# Altium schematic sheet Timer.SchDoc
size A; SheetNumber: 1; SheetTotal: 1
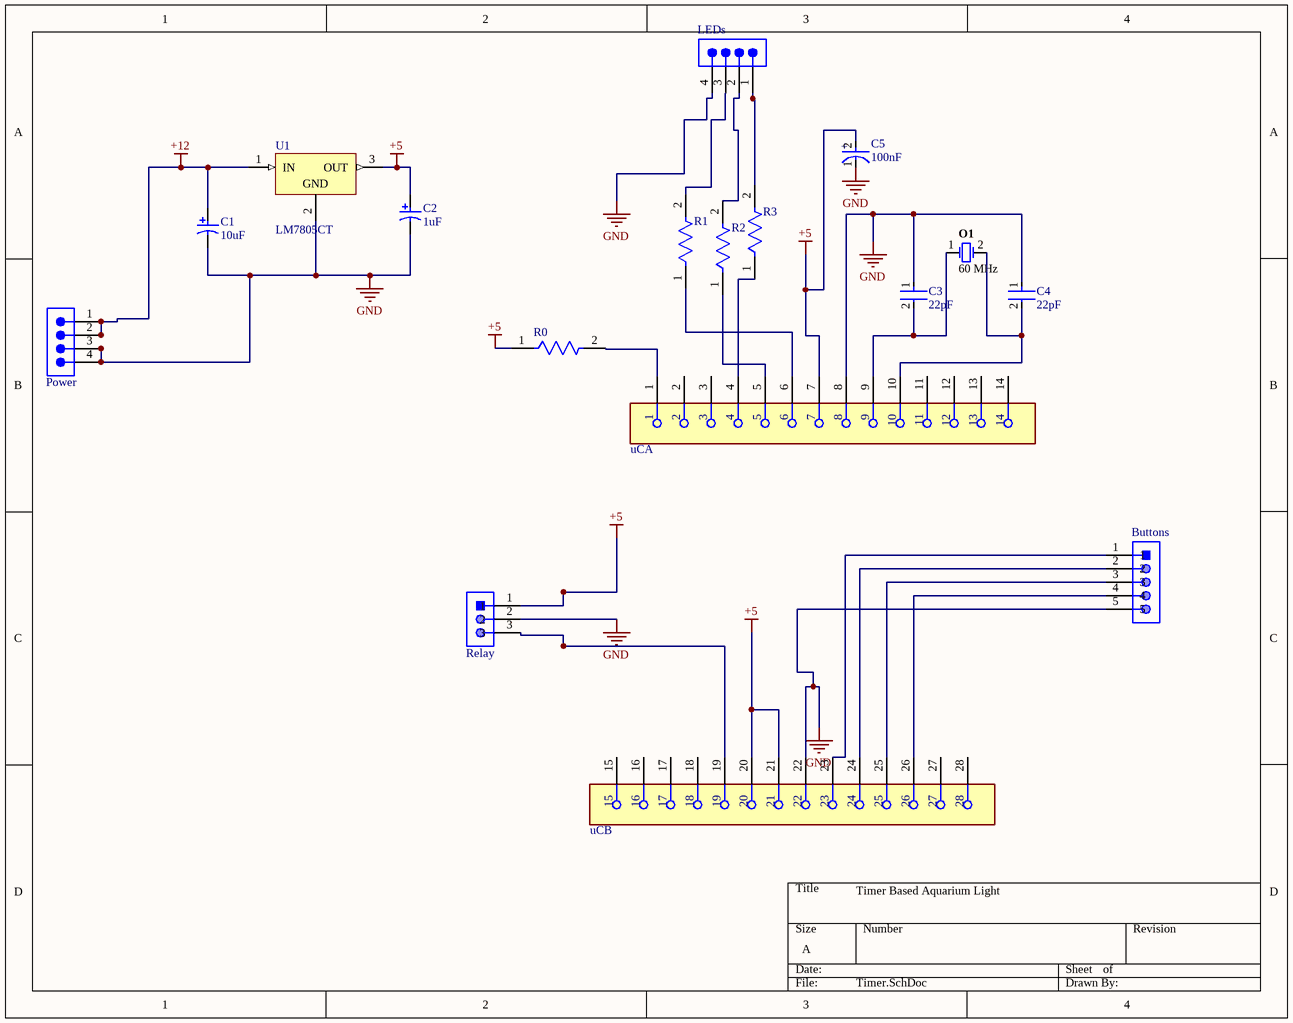
[diagram p0: Timer.SchDoc]

## Parts
Buttons  61300511121  [61300511121]  (value not drawn)
C1  10uF  [CAPPR55-200-1100X500X1200]
C2  1uF  [CAPPR55-200-1100X500X1200]
C3  22pF  [FP-RCE0DB-MFG]
C4  22pF  [FP-RCE0DB-MFG]
C5  100nF  [FP-RAD-TH-D_5_0_5-L_11_1-MFG]
LEDs  TSW-104-08-G-S  [SMTC-TSW-104-08-X-S]  (value not drawn)
O1  60 MHz  [FOX-FOXSLF160-20]
Power  TSW-104-08-G-S  [SMTC-TSW-104-08-X-S]  (value not drawn)
R0  CF18JT2K20  [FP-CF18-MFG]  (value not drawn)
R1  CF18JT2K20  [FP-CF18-MFG]  (value not drawn)
R2  CF18JT2K20  [FP-CF18-MFG]  (value not drawn)
R3  CF18JT2K20  [FP-CF18-MFG]  (value not drawn)
Relay  61900311121  [61900311121]  (value not drawn)
U1  LM7805CT  [FAIR-TO-220-3]
uC  1-2199298-9  [FP-1-2199298-9-MFG]  (value not drawn)  (parts A,B of 2)

## Nets
+5: C2.1 C5.2(A) R0.1 Relay.1 U1.3(OUT) uC.7 uC.20 uC.21
+12: C1.1 Power.1 Power.2 U1.1(IN)
GND: Buttons.5 C1.2 C2.2 C3.1 C4.1 C5.1(C) LEDs.4 Power.3 Power.4 Relay.2 U1.2(GND) uC.8 uC.22
NetButtons_1: Buttons.1 uC.23
NetButtons_2: Buttons.2 uC.24
NetButtons_3: Buttons.3 uC.25
NetButtons_4: Buttons.4 uC.26
NetC3_2: C3.2 O1.1 uC.9
NetC4_2: C4.2 O1.2 uC.10
NetLEDs_1: LEDs.1 R3.2
NetLEDs_2: LEDs.2 R2.2
NetLEDs_3: LEDs.3 R1.2
NetR0_2: R0.2 uC.1
NetR1_1: R1.1 uC.6
NetR2_1: R2.1 uC.5
NetR3_1: R3.1 uC.4
NetRelay_3: Relay.3 uC.19

Not connected (* = marked no-connect by the designer): uC 2 3 11 12 13 14 15 16 17 18 27 28

## Notes on the sheet
- Timer Based Aquarium Light
- (in symbol CMP-05427-001672-1) +

## Library data of the parts
Buttons = CMP-1502-01068-1: THT Vertical Pin Header WR-PHD, Pitch 2.54 mm, Single Row, 5 pins; Manufacturer: Wurth Elektronik; Pin Number: 5; Contact Resistance: 20mOhm; Working Voltage: 250VAC; Pitch: 2.54mm; Withstanding Voltage: 500VAC; Rated Current: 3A; Gender: Male; Datasheet URL: https://katalog.we-online.de/em/datasheet/6130xx11121.pdf; Orientation: Vertical; Mounting Technology: THT; Row Number: Single; Package Reference: 61300511121; Publisher: WurthElektronik; Part Number: 61300511121; Packaging: Bag; Manufacturer URL: http://www.we-online.de; Operating Temperature: -40to105degC
C1 = CMP-1665-00038-2: Aluminum Electrolytic Capacitor, 10 uF, +/- 20%, 50 V, -40 to 85 degC, 2-Pin THD, RoHS, Bulk; Manufacturer: Panasonic; Life (Hours): 2000Hour; Lead/Base Style: Straight; Dissipation Factor: 0.12%; Leakage Current: 3uA; Dielectric Material: Aluminium; Lead Diameter: 0.5mm; Voltage Rating: 50V; Ripple Current: 65mA; Package Reference: CAPPR55-200-1100X500X1200; Height: 11mm; Diameter: 5mm; REACH SVHC: NoSVHC; Mount: ThroughHole; Packaging: Bulk; Manufacturer URL: http://www.panasonic.com/; Capacitance: 10uF; Termination: Radial; Datasheet URL: https://industrial.panasonic.com/cdbs/www-data/pdf/RDF0000/ABA0000C1218.pdf; Lead Free: LeadFree; Height - Seated (Max): 0.472inch; Case/Package: Radial; Package Description: 2-Pin Radial Lead, Dia 5 mm, Height 12 mm; Tolerance: 20%; Datasheet Version: Rev. 05, 10/2016; Package Quantity: 200; Ripple Current (AC): 65mA; Min Operating Temperature: -40degC; RoHSCompliant: true; Number of Pins: 2; Max Operating Temperature: 85degC; Voltage: 50V; Lead Pitch: 2mm; Radiation Hardening: No; Voltage Rating (DC): 50V; Length: 11mm
C2 = CMP-1665-00038-2: Aluminum Electrolytic Capacitor, 10 uF, +/- 20%, 50 V, -40 to 85 degC, 2-Pin THD, RoHS, Bulk; Manufacturer: Panasonic; Life (Hours): 2000Hour; Lead/Base Style: Straight; Dissipation Factor: 0.12%; Capacitance: 10uF; Leakage Current: 3uA; Dielectric Material: Aluminium; Lead Diameter: 0.5mm; Voltage Rating: 50V; Ripple Current: 65mA; Package Reference: CAPPR55-200-1100X500X1200; Height: 11mm; Diameter: 5mm; REACH SVHC: NoSVHC; Mount: ThroughHole; Packaging: Bulk; Manufacturer URL: http://www.panasonic.com/; Termination: Radial; Datasheet URL: https://industrial.panasonic.com/cdbs/www-data/pdf/RDF0000/ABA0000C1218.pdf; Lead Free: LeadFree; Height - Seated (Max): 0.472inch; Case/Package: Radial; Package Description: 2-Pin Radial Lead, Dia 5 mm, Height 12 mm; Tolerance: 20%; Datasheet Version: Rev. 05, 10/2016; Package Quantity: 200; Ripple Current (AC): 65mA; Min Operating Temperature: -40degC; RoHSCompliant: true; Number of Pins: 2; Max Operating Temperature: 85degC; Voltage: 50V; Lead Pitch: 2mm; Radiation Hardening: No; Voltage Rating (DC): 50V; Length: 11mm
C3 C4 = CMP-06035-047347-1: Cap Ceramic 22pF 100V C0G ±5% Radial 2.5mm +125°C Ammo Pack; Lead Diameter: 0.5mm; Lead/Base Style: Straight; Height: 3.5mm; Voltage: 100V; Mount: Through Hole; Min Operating Temperature: -55°C; Height - Seated (Max): 0.138inch; Dielectric: C0G; Width: 0.098inch; Depth: 2.5mm; Lead Pitch: 0.098inch; Packaging: Tape and Reel; Voltage Rating (DC): 100V; Capacitance: 22pF; Package Quantity: 2000; Max Operating Temperature: 125°C; Tolerance: 5%; Termination: Radial; Voltage Rating: 100V; Case/Package: Radial; Resistor Type: Ceramic; Length: 3.6mm; Ratings: AEC-Q200
C5 = CMP-05427-001672-1: Aluminum Electrolytic Capacitors (Radial Lead Type) 68uF ±20% 16V; Ripple Current: 280mA; Polarity: Polar; ESR (Equivalent Series Resistance): 300mR; Lead Diameter: 0.5mm; Life (Hours): 5000Hour; Voltage Rating: 16V; Tolerance: 20%; Lead Pitch: 5mm; Mount: Through Hole; Radiation Hardening: No; Capacitance: 68uF; Termination: Radial; Max Operating Temperature: 105°C; Min Operating Temperature: -40°C; Height: 11mm; Features: General Purpose; Height - Seated (Max): 0.433inch; Package Quantity: 2000; Voltage Rating (DC): 16V; Length: 11mm; Packaging: Tape and Reel; Diameter: 5mm; Series: FR; Impedance: 300mR; RoHS Compliant: Yes; REACH SVHC: No SVHC; Case/Package: Radial
LEDs Power = CMP-1024-00357-1: 0.025" SQ Post Header, Through-hole, Vertical, -55 to 125 degC, 2.54 mm Pitch, 4-Pin, Male, RoHS; Manufacturer: Samtec; Pitch: 2.54 mm; RoHS: True; ComponentLink3URL: http://www.samtec.com/documents/webfiles/cpdf/TSW-XXX-XX-XXX-X-XX-XXX-MKT.pdf; Mounting Technology: Through-hole; ComponentLink2URL: http://www.samtec.com/documents/webfiles/pdf/TSW_TH.PDF; ComponentLink1URL: http://www.samtec.com; ComponentLink3Description: Package Specification; PackageVersion: DM, 8/1988; ComponentLink2Description: Datasheet; PackageReference: TSW-104-08-X-S; PackageDescription: .025[0.64] SQ. Post Terminal Strip Assembly; PartNumber: TSW-104-08-G-S; ComponentLink1Description: Manufacturer URL; Temperature Range: -55 to 125 degC; DatasheetVersion: F-214; Orientation: Vertical
O1 = CMP-1749-00003-1: Resistance Weld Thru-Hole Crystal, 16 MHz, -20 to 70 degC, 2-Pin THD, RoHS, Bulk; Voltage Rating: 250 V; Tolerance: 1%; Resistance: 221 kohm; Case\Package: Axial; Power Rating: 250 mW; RoHSCompliant: true; Package Quantity: 200; Packaging: Bulk; Min Operating Temperature: -55 degC; DatasheetVersion: Mar-15; ComponentLink1URL: http://www.foxonline.com/; Max Operating Temperature: 155 degC; PackageReference: FOXSLF160-20; Mount: Through Hole; PackageDescription: 2-Pin Through Hole Device, Body 11.35 x 4.65 mm; ComponentLink1Description: Manufacturer URL; ComponentLink2URL: http://www.foxonline.com/pdfs/hc49slf.pdf; ComponentLink2Description: Datasheet; Length: 0.248 inch
R0-R3 = CMP-26528-000001-1: RES 2.2K OHM 1/8W 5% CF AXIAL; Manufacturer: Stackpole Electronics Inc; Value: 2.2kΩ; Voltage Rating: 250V; Temperature Coefficient: 0/-400ppm/°C; Power Rating: 0.125W; Composition: Carbon Film; Octopart: https://octopart.com/cf18jt2k20-stackpole+electronics-19205714; Tolerance: 5%; Series: CF; Temperature Range Low: -55°C; ComponentLink2URL: https://www.seielect.com/catalog/sei-cf_cfm.pdf; Ipc Land Pattern Name: RESAD656W65L360D200; Package: CF18; Device Class L2: Resistors; Device Class L3: Through-Hole Resistors; Resistance: 2.2kΩ; Height: 2mm; Category: Res; ComponentLink2Description: Datasheet; Manufacturer Part Number: CF18JT2K20; Lead Free: Yes; Temperature Range High: +155°C; Temperature: -55°C to +155°C; RoHS: TRUE; Device Class L1: Passive Components; Digikey Description: RES 2.2K OHM 1/8W 5% CF AXIAL; Automotive: No
Relay = CMP-1502-00585-1: Male Locking Header WR-WTB, THT, Vertical, pitch 2.54 mm, 1 x 3 position; Manufacturer: Wurth Elektronik; Contact Resistance: 20mOhm; Pitch: 2.54mm; Working Voltage: 250VAC; Position: 1x3; Mounting Technology: THT; Operating Temperature: -40to105degC; Part Number: 61900311121; Datasheet URL: https://katalog.we-online.de/em/datasheet/6190xx11121.pdf; Manufacturer URL: http://www.we-online.de; Publisher: WurthElektronik; Orientation: Vertical; Gender: Male; Package Reference: 61900311121; Packaging: Bag
U1 = CMP-2000-04938-1: Positive Voltage Regulator, 5 V, 1 A, -40 to 125 degC, 3-Pin TO-220, RoHS, Tube; Manufacturer: FairchildSemiconductor; Maximum Input Voltage: 35V; Maximum Quiescent Current: 8mA; Load Regulation: 100mV; Maximum Output Current: 2.2(Typ)A; Output Type: Fixed; Typical Dropout Voltage @ Current: 2@1AV; Rad Hard: No; Output Voltage: 5V; Accuracy: ±4%; Number of Outputs: 1; Category: LinearRegulator; Package Description: 3-Pin Through Hole Device, Body 10 x 4.5 mm, Pitch 2.54 mm; Packaging: Rail/Tube; Mounting: ThroughHole; Polarity: Positive; Manufacturer URL: https://www.fairchildsemi.com/; Line Regulation: 100mV; Datasheet Version: Aug-12; Datasheet URL: https://datasheet.ciiva.com/26904/lm7805ct-26904988.pdf; Package Reference: TO-220; Package URL: https://www.fairchildsemi.com/package-drawings/TO/TO220B03.pdf; Package: 3TO-220AB; Operating Temperature: -40to125degC; Type: Linear
uC = CMP-03370-000006-1: CONN IC DIP SOCKET 28POS TIN; Pitch: 2.54mm; Insulation Resistance: 1GR; Number of Poles: 28; Contact Post Length: 3inch; Contact Current Rating: 1A; Connector Type: Pin; Mating Alignment: Yes (With); Row Spacing: 0.3inch; Orientation: Straight; ELV: Compliant; Termination: Through Hole; Mount: Through Hole; Package Quantity: 17; Contact Material: Bronze; Number of Rows: 2; Packaging: Rail/Tube; Contact Plating: Tin; Current Rating: 1A; Radiation Hardening: No; Min Operating Temperature: -40°C; Housing Material: PBT; Number of Contacts: 28; Color: Black; Max Operating Temperature: 105°C; Flammability Rating: UL94 V-0; Number of Positions: 28; Insulation Material: Thermoplastic; RoHS Compliant: Yes; Length: 1.4inch